# Altium schematic sheet WL_144.SchDoc
size 594 x 420 mm; SheetNumber: 7; SheetTotal: 9
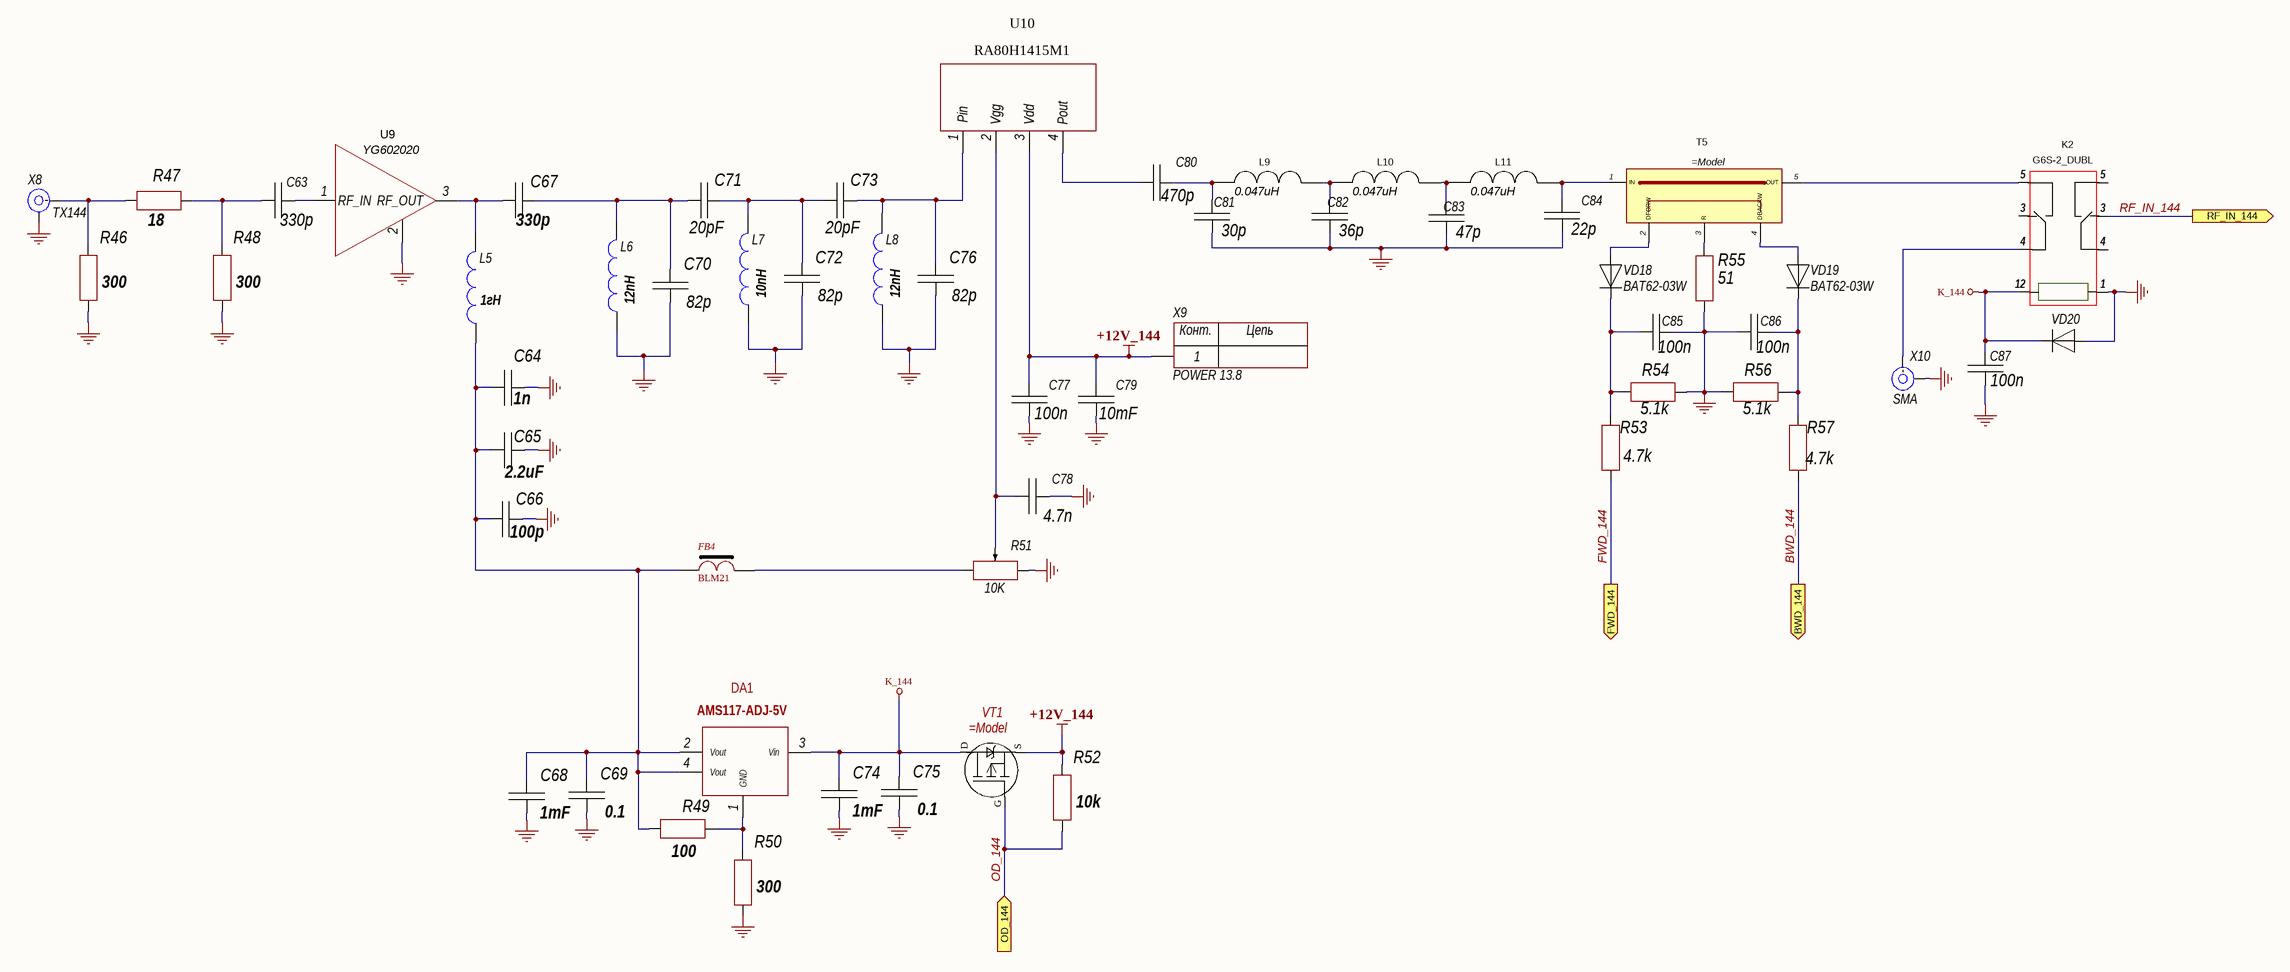
[diagram p0: WL_144.SchDoc]

## Parts
C63  330p  [CH0805C]
C64  1n  [CH0805C]
C65  2.2uF  [CH0805C]
C66  100p  [CH0805C]
C67  330p  [CH0805C]
C68  1mF  [CH0805C]
C69  0.1  [CH0805C]
C70  82p  [CH0805C]
C71  20pF  [CH0805C]
C72  82p  [CH0805C]
C73  20pF  [CH0805C]
C74  1mF  [CH0805C]
C75  0.1  [CH0805C]
C76  82p  [CH0805C]
C77  100n  [CH1206C]
C78  4.7n  [CH0805C]
C79  10mF  [CH1206C]
C80  470p  [CH1206C]
C81  30p  [CH1206C]
C82  36p  [CH1206C]
C83  47p  [CH1206C]
C84  22p  [CH1206C]
C85  100n  [CH0805C]
C86  100n  [CH0805C]
C87  100n  [CH0805C]
DA1  AMS117-ADJ-5V  [SOT223]
FB4  BLM21  [CH0805L]
K2  G6S-2_DUBL  [G6S-2_DUBL]
L5  1гH  [katuhka]
L6  12nH  [katuhka]
L7  10nH  [katuhka]
L8  12nH  [katuhka]
L9  0.047uH  [L-FNC_V3]
L10  0.047uH  [L-FNC_V3]
L11  0.047uH  [L-FNC_V3]
R46  300  [CH0805R]
R47  18  [CH0805R]
R48  300  [CH0805R]
R49  100  [CH0805R]
R50  300  [CH0805R]
R51  10K  [RES: 3296W]
R52  10k  [CH0805R]
R53  4.7k  [CH0805R]
R54  5.1k  [CH0805R]
R55  51  [CH1206R]
R56  5.1k  [CH0805R]
R57  4.7k  [CH0805R]
T5  (no value)  [SWR_D]
U9  YG602020  [SOT89_123]
U10  RA80H1415M1  [RA80H1415M1 - duplicate]
VD18  BAT62-03W  [1N4148]
VD19  BAT62-03W  [1N4148]
VD20  (no value)  [1N4148]
VT1  (no value)  [SOT23_132]
X8  TX144  [CON: u.Fl]
X9  POWER 13.8  [CON: KNIFE_5MM]
X10  SMA  [CON: SMA]

## Ports
BWD_144 (out), FWD_144 (out), OD_144 (in), RF_IN_144 (out)

## Nets
+12V_144: C77.2 C79.2 R52.2 U10.3(Vdd) VT1.2(Исток) X9.1
GND: C64.2 C65.2 C66.2 C68.1 C69.1 C70.1 C72.1 C74.1 C75.1 C76.1 C77.1 C78.1 C79.1 C81.1 C82.1 C83.1 C84.1 C85.1 C86.2 C87.2 K2.1 L6.2 L7.2 L8.2 R46.1 R48.1 R50.1 R51.3 R54.1 R55.1 R56.2 U9.2(GND) VD20.1 X8.2(IN) X10.2(IN)
K_144: C74.2 C75.2 C87.1 DA1.3(Vin) K2.12 VD20.2 VT1.3(Сток)
BWD_144: R57.2 ; port BWD_144
FWD_144: R53.2 ; port FWD_144
OD_144: R52.1 VT1.1(Затвор(Gate)) ; port OD_144
RF_IN_144: K2.3 ; port RF_IN_144
NetC63_1: C63.1 U9.1(RF_IN)
NetC63_2: C63.2 R47.1 R48.2
NetC64_1: C64.1 C65.1 C66.1 C68.2 C69.2 DA1.2(Vout) DA1.4(Vout) FB4.1 L5.2 R49.2
NetC67_1: C67.1 L5.1 U9.3(RF_OUT)
NetC67_2: C67.2 C70.2 C71.1 L6.1
NetC71_2: C71.2 C72.2 C73.1 L7.1
NetC73_2: C73.2 C76.2 L8.1 U10.1(Pin)
NetC78_2: C78.2 R51.2 U10.2(Vgg)
NetC80_1: C80.1 C81.2 L9.1
NetC80_2: C80.2 U10.4(Pout)
NetC82_2: C82.2 L9.2 L10.1
NetC83_2: C83.2 L10.2 L11.1
NetC84_2: C84.2 L11.2 T5.1(IN)
NetC85_2: C85.2 R53.1 R54.2 VD18.2
NetC86_1: C86.1 R56.1 R57.1 VD19.2
NetDA1_1: DA1.1(GND) R49.1 R50.2
NetFB4_2: FB4.2 R51.1
NetK2_4: K2.4 X10.1(IN)
NetK2_5: K2.5 T5.5(OUT)
NetR46_2: R46.2 R47.2 X8.1(IN)
NetR55_2: R55.2 T5.3(R)
NetT5_2: T5.2(DFORW) VD18.1
NetT5_4: T5.4(DBACKW) VD19.1

## Notes on the sheet
- Перв. примен.
- Справ. №
- Подп. и дата
- Инв. № дубл.
- Взам. инв. №
- Инв. № подл.
- Изм.
- Лист
- № докум.
- Подп.
- Дата
- 2.106-A2
- Копировал
- Формат А2
- (in symbol 1-Connector) Конт.; Цепь
- (in symbol P-KANAL) D; S; G

## Library data of the parts
C63-C87 = Capacitor: Manufacturer: *; Model: *; HelpURL: *; ComponentKind: *; Value: *
DA1 = AMS117
FB4 = FB-1
L5-L8 = Inductor ring: Value: {Value}; Model: *; ComponentKind: *; Manufacturer: *; HelpURL: *
L9-L11 = TRANS-1
R46-R50 R52-R57 = Resistor: Manufacturer: *; Model: *; HelpURL: *; ComponentKind: *; Value: *
R51 = ADJ resistor: Manufacturer: *; Model: *; HelpURL: *; ComponentKind: *; Value: *
T5 = VHF_KSV1
VD18-VD20 = Diod: ComponentKind: *; Manufacturer: *; Model: *; HelpURL: *
VT1 = P-KANAL
X8 X10 = SMA: RF; Model: *; Manufacturer: *; HelpURL: *; ComponentKind: *
X9 = 1-Connector: Model: *; Manufacturer: *; HelpURL: *; ComponentKind: *